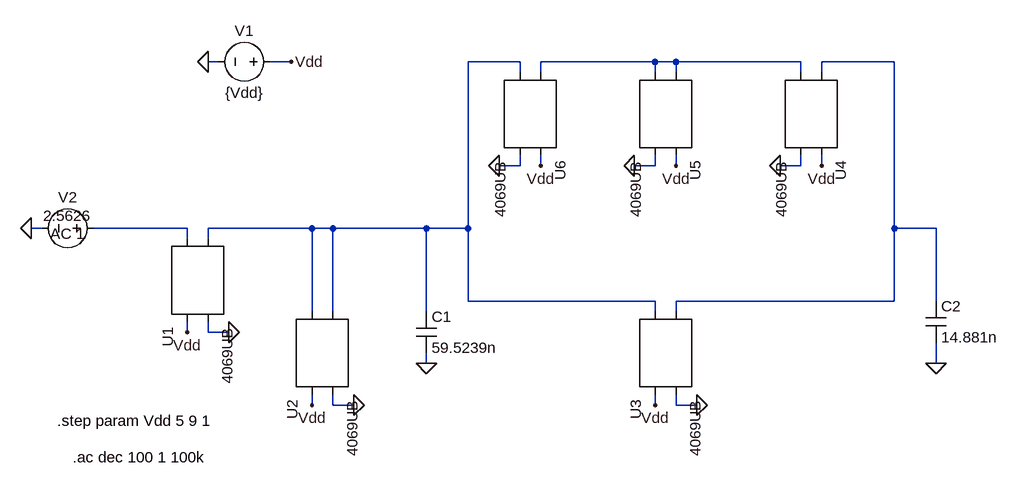
[diagram p0: schematic band pass filter with CMOS inverter.asc]
band pass filter with CMOS inverter.asc, the LTspice schematic file:
Version 4
SHEET 1 1240 680
WIRE 16 -272 0 -272
WIRE 128 -272 96 -272
WIRE 480 -272 400 -272
WIRE 688 -272 512 -272
WIRE 720 -272 688 -272
WIRE 912 -272 720 -272
WIRE 1056 -272 944 -272
WIRE 480 -256 480 -272
WIRE 512 -256 512 -272
WIRE 688 -256 688 -272
WIRE 720 -256 720 -272
WIRE 912 -256 912 -272
WIRE 944 -256 944 -272
WIRE 480 -112 480 -128
WIRE 480 -112 448 -112
WIRE 512 -112 512 -128
WIRE 688 -112 688 -128
WIRE 688 -112 656 -112
WIRE 720 -112 720 -128
WIRE 912 -112 912 -128
WIRE 912 -112 880 -112
WIRE 944 -112 944 -128
WIRE -256 -16 -272 -16
WIRE -32 -16 -176 -16
WIRE 160 -16 0 -16
WIRE 192 -16 160 -16
WIRE 336 -16 192 -16
WIRE 400 -16 400 -272
WIRE 400 -16 336 -16
WIRE 1056 -16 1056 -272
WIRE 1120 -16 1056 -16
WIRE -32 0 -32 -16
WIRE 0 0 0 -16
WIRE 400 96 400 -16
WIRE 688 96 400 96
WIRE 1056 96 1056 -16
WIRE 1056 96 720 96
WIRE 1120 96 1120 -16
WIRE 160 112 160 -16
WIRE 192 112 192 -16
WIRE 336 112 336 -16
WIRE 688 112 688 96
WIRE 720 112 720 96
WIRE -32 144 -32 128
WIRE 0 144 0 128
WIRE 32 144 0 144
WIRE 336 192 336 176
WIRE 1120 192 1120 160
WIRE 160 256 160 240
WIRE 192 256 192 240
WIRE 224 256 192 256
WIRE 688 256 688 240
WIRE 720 256 720 240
WIRE 752 256 720 256
FLAG 32 144 0
FLAG 224 256 0
FLAG 336 192 0
FLAG 1120 192 0
FLAG 752 256 0
FLAG 880 -112 0
FLAG 656 -112 0
FLAG 448 -112 0
FLAG 0 -272 0
FLAG 128 -272 Vdd
FLAG -32 144 Vdd
FLAG 160 256 Vdd
FLAG 512 -112 Vdd
FLAG 720 -112 Vdd
FLAG 944 -112 Vdd
FLAG 688 256 Vdd
FLAG -272 -16 0
SYMBOL AutoGenerated\\4069UB -16 64 M90
SYMATTR InstName U1
SYMBOL AutoGenerated\\4069UB 176 176 M90
SYMATTR InstName U2
SYMBOL AutoGenerated\\4069UB 704 176 M90
SYMATTR InstName U3
SYMBOL cap 320 112 R0
SYMATTR InstName C1
SYMATTR Value 59.5239n
SYMBOL AutoGenerated\\4069UB 928 -192 R90
SYMATTR InstName U4
SYMBOL AutoGenerated\\4069UB 704 -192 R90
SYMATTR InstName U5
SYMBOL AutoGenerated\\4069UB 496 -192 R90
SYMATTR InstName U6
SYMBOL cap 1104 96 R0
SYMATTR InstName C2
SYMATTR Value 14.881n
SYMBOL voltage 112 -272 R90
WINDOW 0 -32 56 VBottom 2
WINDOW 3 32 56 VTop 2
WINDOW 123 0 0 Left 0
WINDOW 39 0 0 Left 0
SYMATTR InstName V1
SYMATTR Value {Vdd}
SYMBOL voltage -160 -16 R90
WINDOW 0 -32 56 VBottom 2
WINDOW 3 -4 56 VBottom 2
WINDOW 123 24 56 VBottom 2
WINDOW 39 0 0 Left 0
SYMATTR InstName V2
SYMATTR Value 2.5626
SYMATTR Value2 AC 1
TEXT -208 336 Left 2 !.ac dec 100 1 100k
TEXT -232 280 Left 2 !.step param Vdd 5 9 1

The netlist it stands for:
* band pass filter with CMOS inverter.asc
* U1: 4069UB (symbol AutoGenerated\4069UB not available, pins judged from their places): pin1=N004 pin2=N001 pin3=Vdd pin4=0
* U2: 4069UB (symbol AutoGenerated\4069UB not available, pins judged from their places): pin1=N001 pin2=N001 pin3=Vdd pin4=0
* U3: 4069UB (symbol AutoGenerated\4069UB not available, pins judged from their places): pin1=N001 pin2=N003 pin3=Vdd pin4=0
C1 N001 0 59.5239n
* U4: 4069UB (symbol AutoGenerated\4069UB not available, pins judged from their places): pin1=N003 pin2=N002 pin3=Vdd pin4=0
* U5: 4069UB (symbol AutoGenerated\4069UB not available, pins judged from their places): pin1=N002 pin2=N002 pin3=Vdd pin4=0
* U6: 4069UB (symbol AutoGenerated\4069UB not available, pins judged from their places): pin1=N002 pin2=N001 pin3=Vdd pin4=0
C2 N003 0 14.881n
V1 Vdd 0 {Vdd}
V2 N004 0 2.5626 AC 1
.ac dec 100 1 100k
.step param Vdd 5 9 1
.backanno
.end